# EAGLE design Longboard controller (EAGLE 8.4.1)
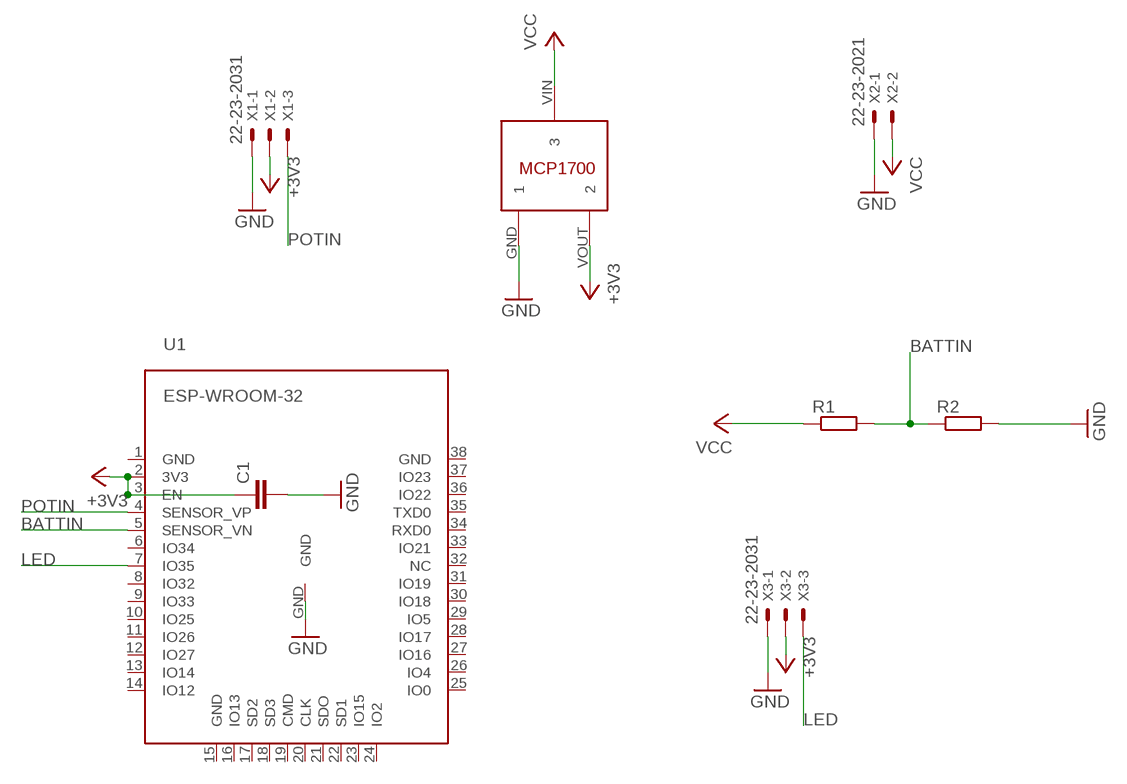
[diagram p0: schematic, sheet 1]

## Parts
C1  C-EUC0402  [C0402]
R1  R-EU_R0805  [R0805]
R2  R-EU_R0805  [R0805]
U1  ESP-WROOM-32  [ESP-WROOM-32]
U$1  MCP1700T-3302E/TT  [MCP1700T-3302E/TT]
X1  22-23-2031  [22-23-2031]
X2  22-23-2021  [22-23-2021]
X3  22-23-2031  [22-23-2031]

## Nets
+3V3: C1.1 U1.2(3V3) U1.3(EN) U$1.VOUT X1.2 X3.2
BATTIN: R1.2 R2.1 U1.5(SENSOR_VN)
GND: C1.2 R2.2 U1.GND U$1.GND X1.1 X2.1 X3.1
LED: U1.7(IO35) X3.3
POTIN: U1.4(SENSOR_VP) X1.3
VCC: R1.1 U$1.VIN X2.2
Unconnected: U1.1(GND) U1.6(IO34) U1.8(IO32) U1.9(IO33) U1.10(IO25) U1.11(IO26) U1.12(IO27) U1.13(IO14) U1.14(IO12) U1.15(GND) U1.16(IO13) U1.17(SD2) U1.18(SD3) U1.19(CMD) U1.20(CLK) U1.21(SDO) U1.22(SD1) U1.23(IO15) U1.24(IO2) U1.25(IO0) U1.26(IO4) U1.27(IO16) U1.28(IO17) U1.29(IO5) U1.30(IO18) U1.31(IO19) U1.32(NC) U1.33(IO21) U1.34(RXD0) U1.35(TXD0) U1.36(IO22) U1.37(IO23) U1.38(GND)

## Library data of the parts
C1 = rcl:C-EU: CAPACITOR, European symbol
R1 R2 = resistor:R-EU_: RESISTOR, European symbol
U1 = esp32_2:ESP-WROOM-32
U$1 = MCP1700T-3302E_TT:MCP1700T-3302E/TT: Microchip LDO "MCP1700" in a 3-Pin SOT-23 package. ID: MCP1700T-3302E/TT
X1 X3 = con-molex:22-23-2031: .100" (2.54mm) Center Header - 3 Pin; MF: MOLEX; MPN: 22-23-2031; OC_FARNELL: 1462950; OC_NEWARK: 30C0862
X2 = con-molex:22-23-2021: .100" (2.54mm) Center Header - 2 Pin; MF: MOLEX; MPN: 22-23-2021; OC_FARNELL: 1462926; OC_NEWARK: 25C3832

## Board
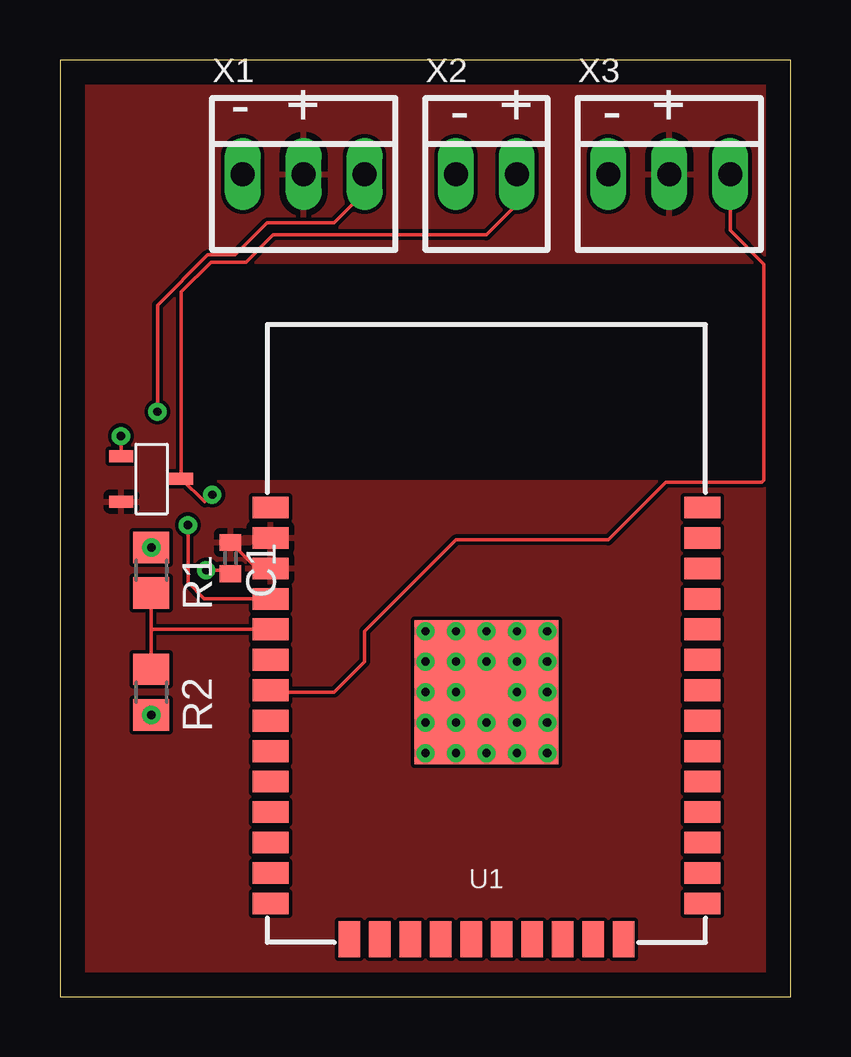
[diagram p1: board, top side]
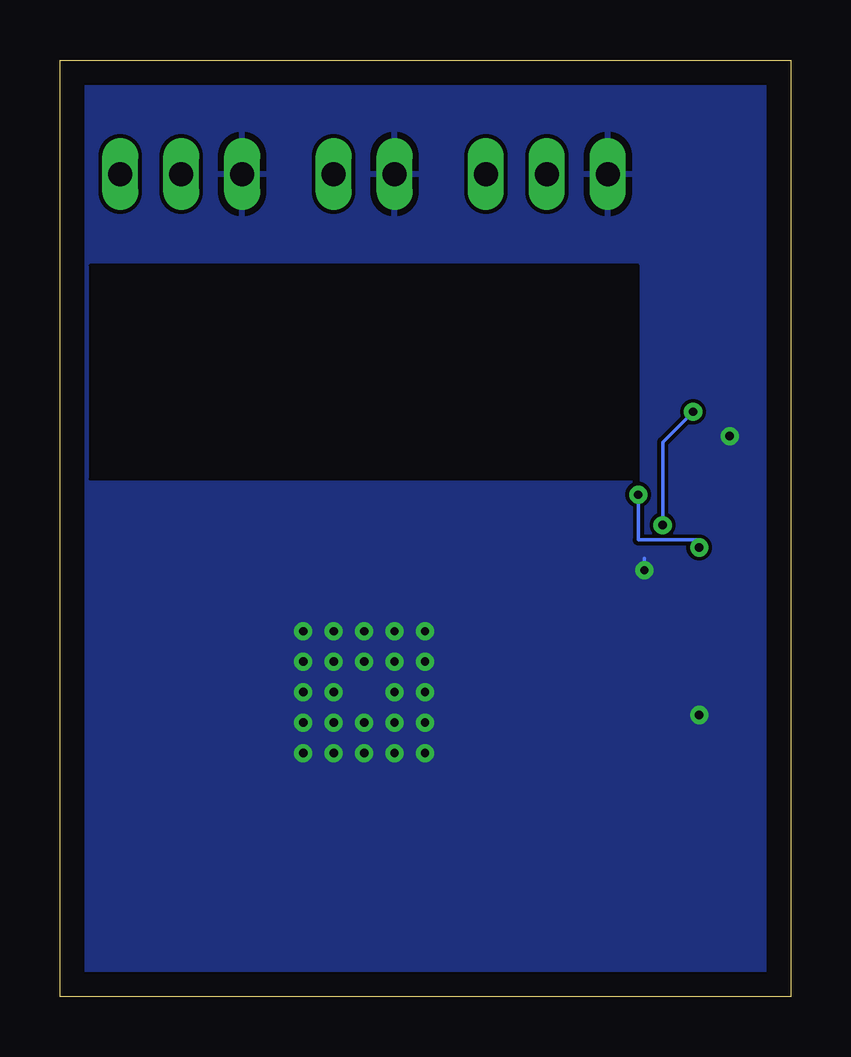
[diagram p2: board, bottom side, seen from below]

Size 30.46 x 39.04 mm. Coordinates in mm from the lower left corner, seen from the top.
Outline: 0,0 30.46,0 30.46,39.04 0,39.04 0,0
Copper layers (1*16): Top 0.035mm / dielectric 1.5mm / Bottom 0.035mm
Design rules "default": minimum track width 6mil, minimum drill 0.35mm, track to track 6mil, track to pad 6mil, pad to pad 6mil, via to via 6mil, smd to smd 6mil, copper to edge 40mil, drill to drill 6mil, minimum pad ring 10mil, minimum via ring 8mil, stop-mask expansion 4mil, vias tented up to drill 0mil, thermal gap 10mil

### Footprints (pad centres in the part's own frame; a part is rotated, then mirrored left to right if it is on the bottom)
C0402 = smd 0.7 x 0.9: 1 -0.65,0; 2 0.65,0
R0805 = smd 1.3 x 1.5: 1 -0.95,0; 2 0.95,0
ESP-WROOM-32 = smd 0.9 x 1.5: 1 7.7,9; 2 6.43,9; 3 5.16,9; 4 3.89,9; 5 2.62,9; 6 1.35,9; 7 0.08,9; 8 -1.19,9; 9 -2.46,9; 10 -3.73,9; 11 -5,9; 12 -6.27,9; 13 -7.54,9; 14 -8.81,9; 25 -8.81,-9; 26 -7.54,-9; 27 -6.27,-9; 28 -5,-9; 29 -3.73,-9; 30 -2.46,-9; 31 -1.19,-9; 32 0.08,-9; 33 1.35,-9; 34 2.62,-9; 35 3.89,-9; 36 5.16,-9; 37 6.43,-9; 38 7.7,-9 | smd 1.5 x 0.9: 15 -10.3,5.715; 16 -10.3,4.445; 17 -10.3,3.175; 18 -10.3,1.905; 19 -10.3,0.635; 20 -10.3,-0.635; 21 -10.3,-1.905; 22 -10.3,-3.175; 23 -10.3,-4.445; 24 -10.3,-5.715 | smd 6 x 6: GND 0,0
MCP1700T-3302E/TT = smd 0.5 x 1: GND -0.95,-1.25; VIN 0,1.25; VOUT 0.95,-1.25
22-23-2031 = drill 1 long: 1 -2.54,0; 2 0,0; 3 2.54,0
22-23-2021 = drill 1 long: 1 -1.27,0; 2 1.27,0

### Placement (x,y rotation side)
C1  7.11,18.29 270 top
R1  3.81,17.78 270 top
R2  3.81,12.7 270 top
U1  17.78,12.7 90 top
U$1  3.81,21.59 270 top
X1  10.16,34.29 0 top
X2  17.78,34.29 0 top
X3  25.4,34.29 0 top

### Tracks (layer width: path | path; a pad name or v marks a point on that pad's centre or on a via)
+3V3
  Top 0.152: C1.1 8.19,17.86 U1.3
  pour Top: 0,0 30.48,0 30.48,39.12 0,39.12
BATTIN
  Top 0.152: R2.1 3.81,15.24 | 3.81,15.24 R1.2 | 3.81,15.24 3.89,15.32 U1.5
GND  (via drill 0.35)
  Top 0.152: U$1.GND 2.56,23.11 2.54,23.13 v2.54,23.37 | U1.GND v16.51,13.97 | C1.2 6.97,17.78 v6.1,17.78
  Bottom 0.152: v6.1,17.78 6.1,18.29
  other vias: 15.24,15.24 16.51,15.24 17.78,15.24 19.05,15.24 20.32,15.24 20.32,13.97 19.05,13.97 17.78,13.97 15.24,13.97 15.24,12.7 16.51,12.7 19.05,12.7 20.32,12.7 20.32,11.43 19.05,11.43 17.78,11.43 16.51,11.43 15.24,11.43 15.24,10.16 16.51,10.16 17.78,10.16 19.05,10.16 20.32,10.16 3.81,11.75
  pour Bottom: 0,39.12 30.48,39.12 30.48,0 0,0
LED
  Top 0.152: X3.3 27.94,31.95 29.35,30.54 29.35,21.53 29.27,21.45 25.26,21.45 22.86,19.05 16.51,19.05 12.7,15.24 12.7,13.97 11.43,12.7 8.86,12.7 U1.7
POTIN  (via drill 0.35)
  Top 0.152: U1.4 6.02,16.59 5.33,17.27 v5.33,19.66 | v4.06,24.38 4.06,28.82 6.17,30.92 7.3,30.92 8.64,32.26 11.43,32.26 12.7,33.53 X1.3
  Bottom 0.152: v5.33,19.66 5.33,23.11 v4.06,24.38
VCC  (via drill 0.35)
  Top 0.152: X2.2 19.05,33.02 17.78,31.75 8.89,31.75 7.76,30.62 6.29,30.62 5.06,29.39 U$1.VIN 6.04,20.63 v6.35,20.93
  Bottom 0.152: v6.35,20.93 6.35,19.05 3.81,19.05 R1.1
  other vias: 3.81,18.73

### Text on the board
tPlace: - | + | - | + | - | +